# Altium schematic sheet Phoenix_Shield.SchDoc
size A4; SheetNumber: 12; SheetTotal: 12
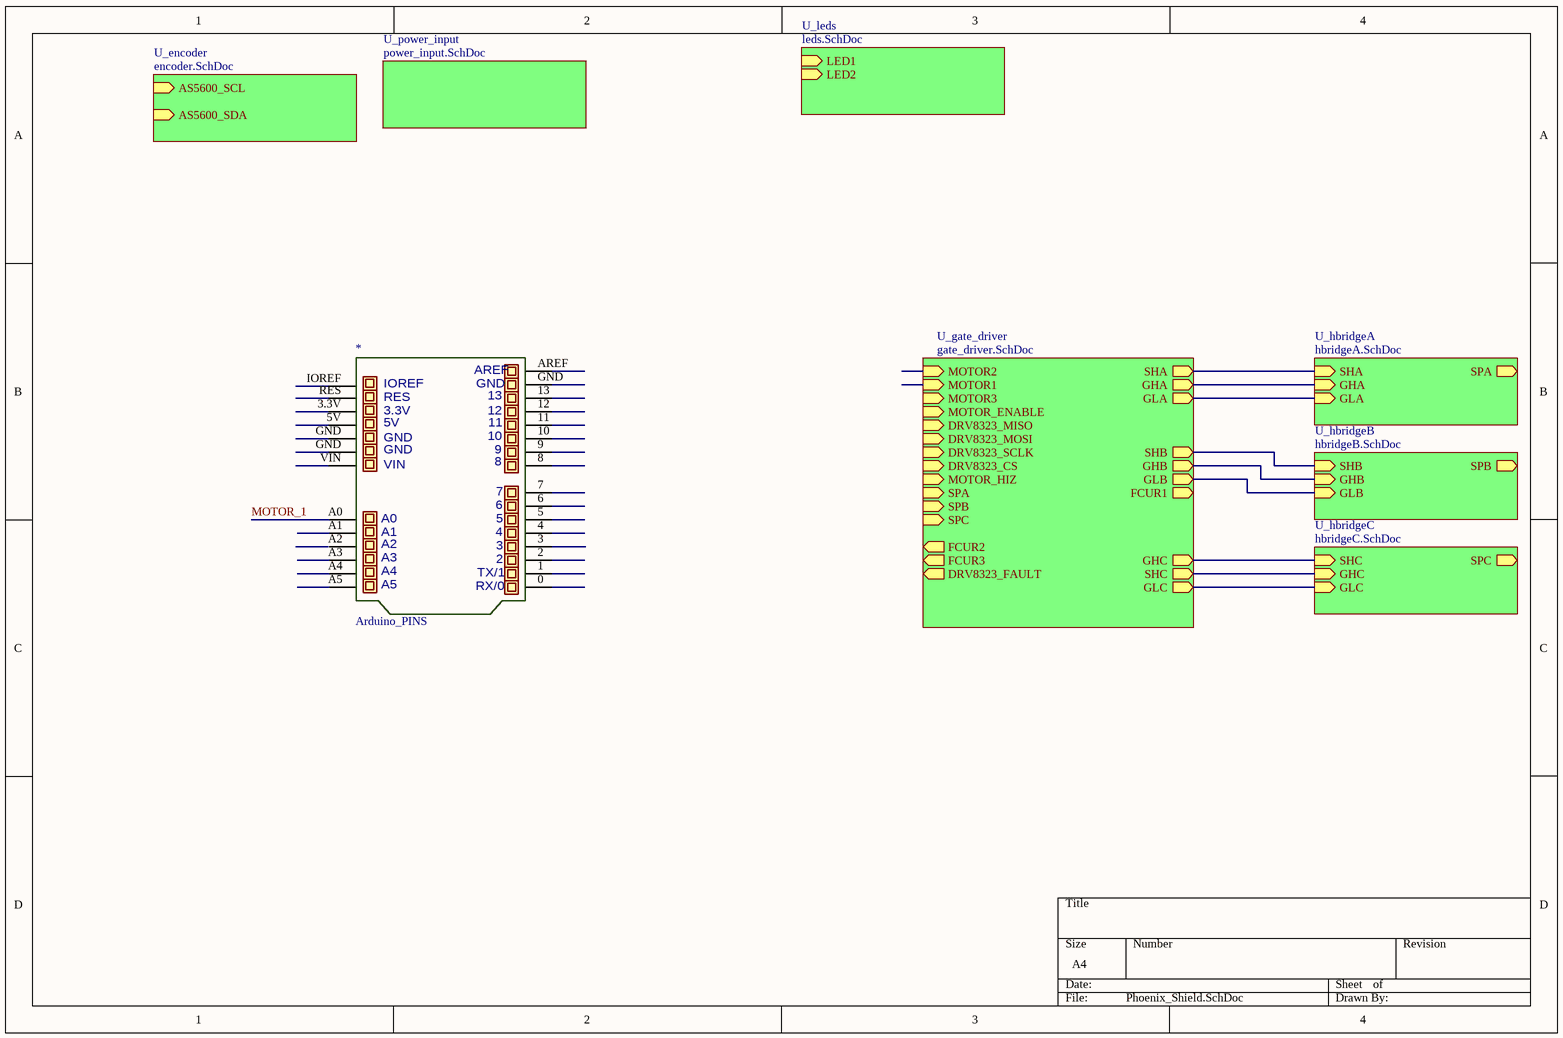
[diagram p0: Phoenix_Shield.SchDoc]

## Parts
*  Arduino_PINS

## Sub-sheets
U_encoder = encoder.SchDoc: AS5600_SCL (in), AS5600_SDA (in)
U_gate_driver = gate_driver.SchDoc: MOTOR2 (in), MOTOR1 (in), MOTOR3 (in), MOTOR_ENABLE (in), DRV8323_MISO (in), DRV8323_MOSI (in), DRV8323_SCLK (in), DRV8323_CS (in), MOTOR_HIZ (in), DRV8323_FAULT (out), GHA (out), SHA (out), GLA (out), SPA (in), GHB (out), SHB (out), GLB (out), SPB (in), GHC (out), SHC (out), GLC (out), SPC (in), FCUR1 (out), FCUR2 (out), FCUR3 (out)
U_hbridgeA = hbridgeA.SchDoc: SHA (in), GHA (in), SPA (out), GLA (in)
U_hbridgeB = hbridgeB.SchDoc: SHB (in), GHB (in), SPB (out), GLB (in)
U_hbridgeC = hbridgeC.SchDoc: SHC (in), GHC (in), SPC (out), GLC (in)
U_leds = leds.SchDoc: LED1 (in), LED2 (in)
U_power_input = power_input.SchDoc: no entries

## Nets
MOTOR_1: *.A0
(unnamed): sheet U_hbridgeA/SHA, sheet U_gate_driver/SHA
(unnamed): sheet U_hbridgeA/GHA, sheet U_gate_driver/GHA
(unnamed): sheet U_hbridgeA/GLA, sheet U_gate_driver/GLA
(unnamed): sheet U_hbridgeB/SHB, sheet U_gate_driver/SHB
(unnamed): sheet U_hbridgeB/GHB, sheet U_gate_driver/GHB
(unnamed): sheet U_hbridgeB/GLB, sheet U_gate_driver/GLB
(unnamed): sheet U_hbridgeC/SHC, sheet U_gate_driver/GHC
(unnamed): sheet U_hbridgeC/GHC, sheet U_gate_driver/SHC
(unnamed): sheet U_hbridgeC/GLC, sheet U_gate_driver/GLC

Not connected (* = marked no-connect by the designer): * 0(RX) 1(TX) 2 3 3.3V 4 5 5V 6 7 8 9 10 11 12 13 A1 A2 A3 A4 A5 AREF GND IOREF RES VIN

## Notes on the sheet
- (in symbol Arduino_PINS) TX/1; RX/0